# EAGLE board A6BP-3 (EAGLE 7.5.0), part 1 of 2
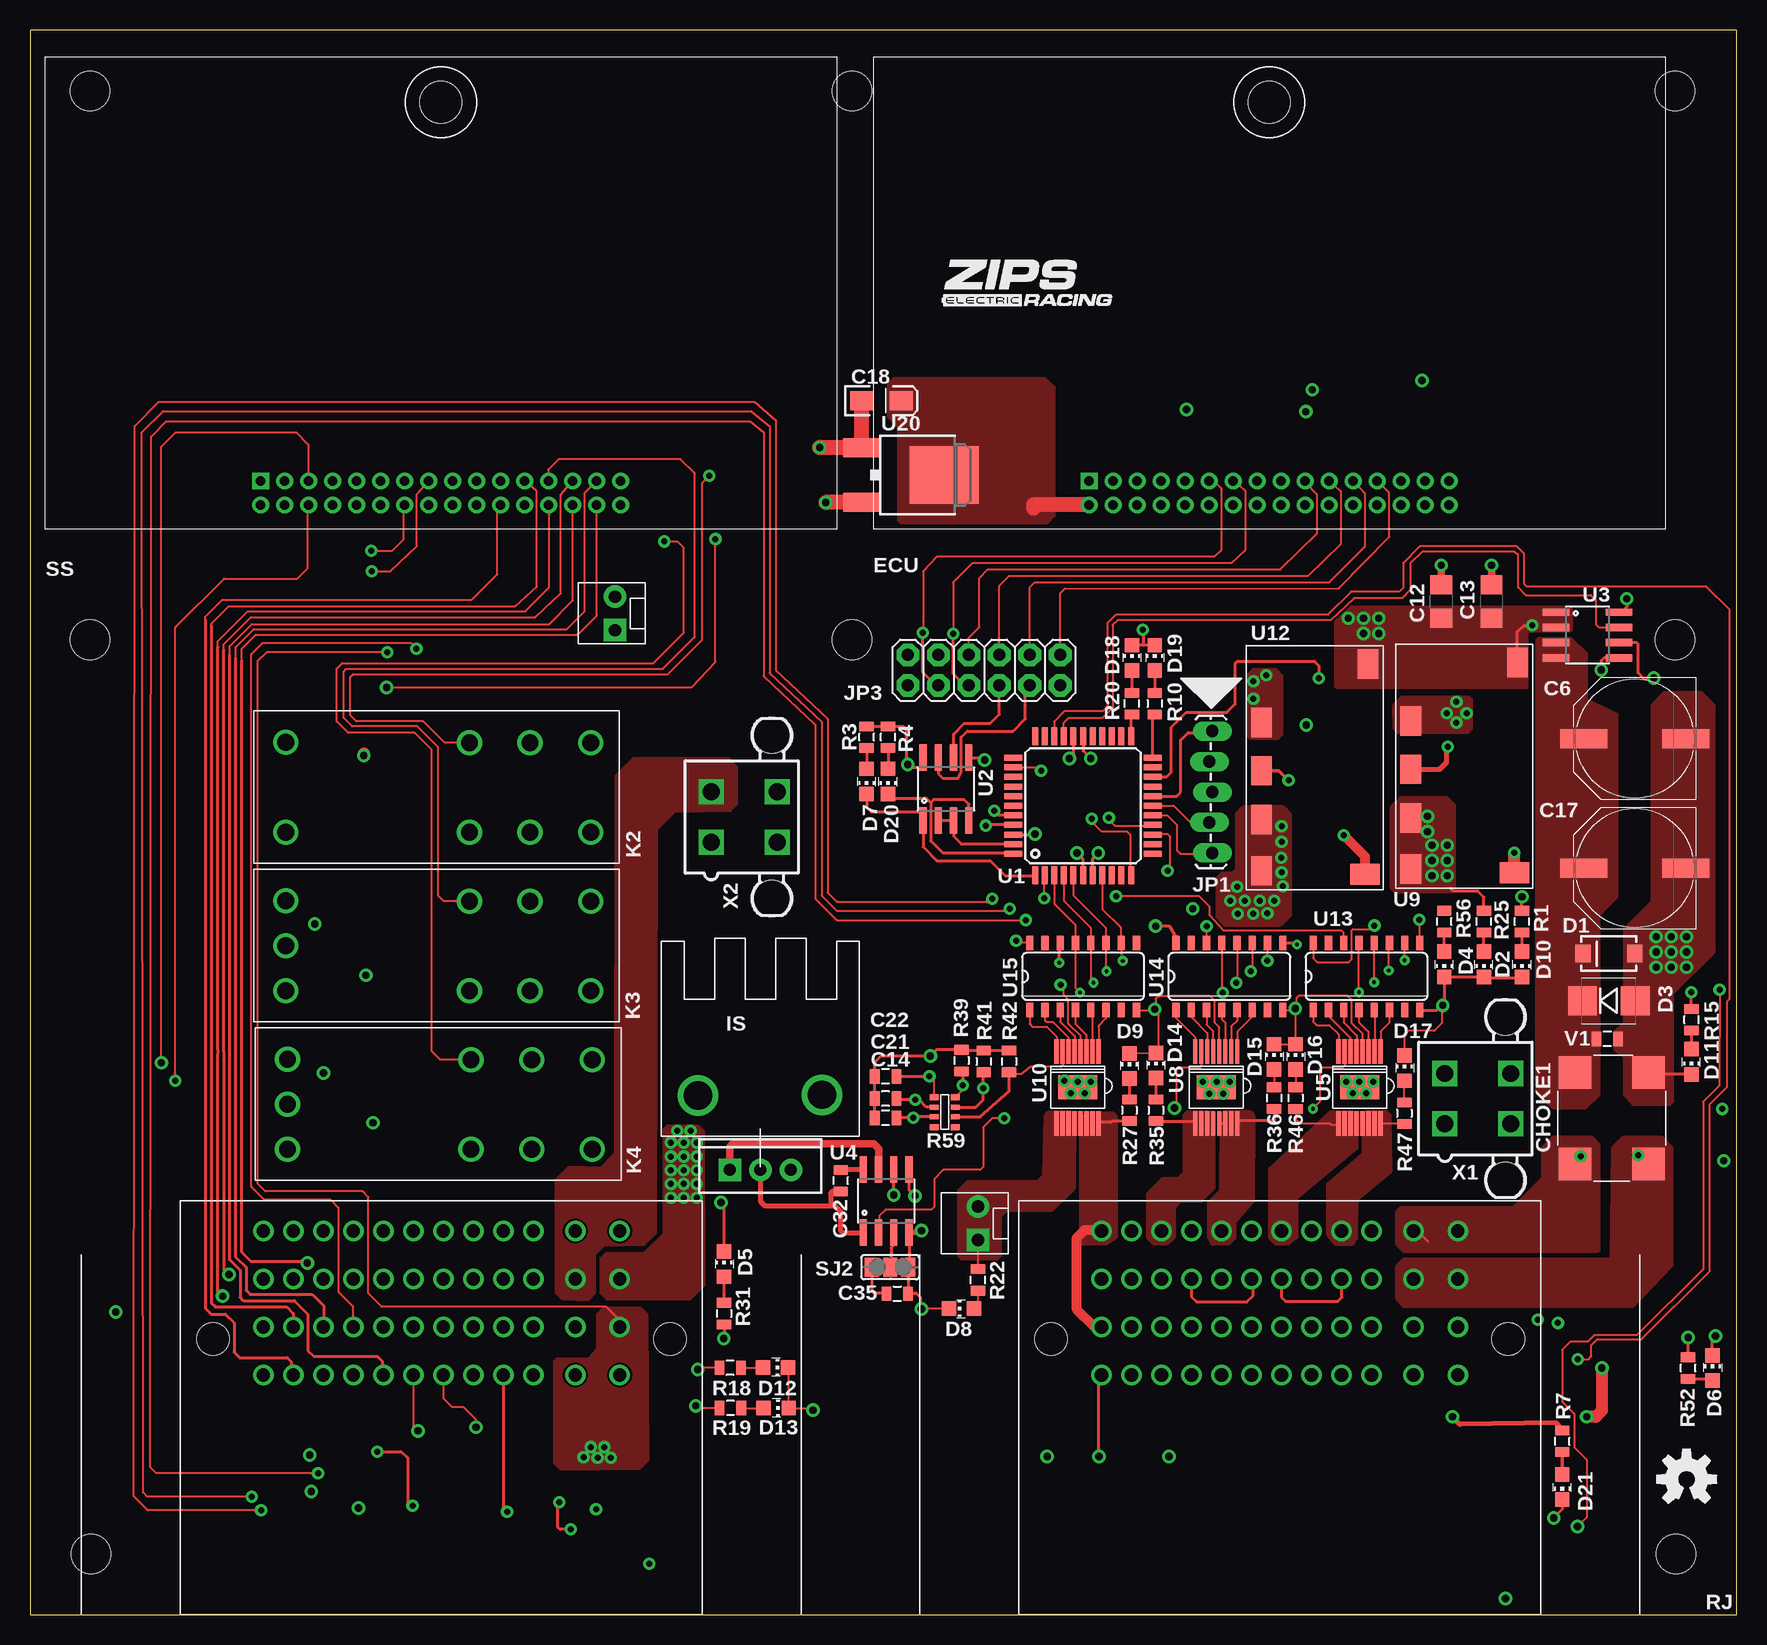
[diagram p6: board, top side]
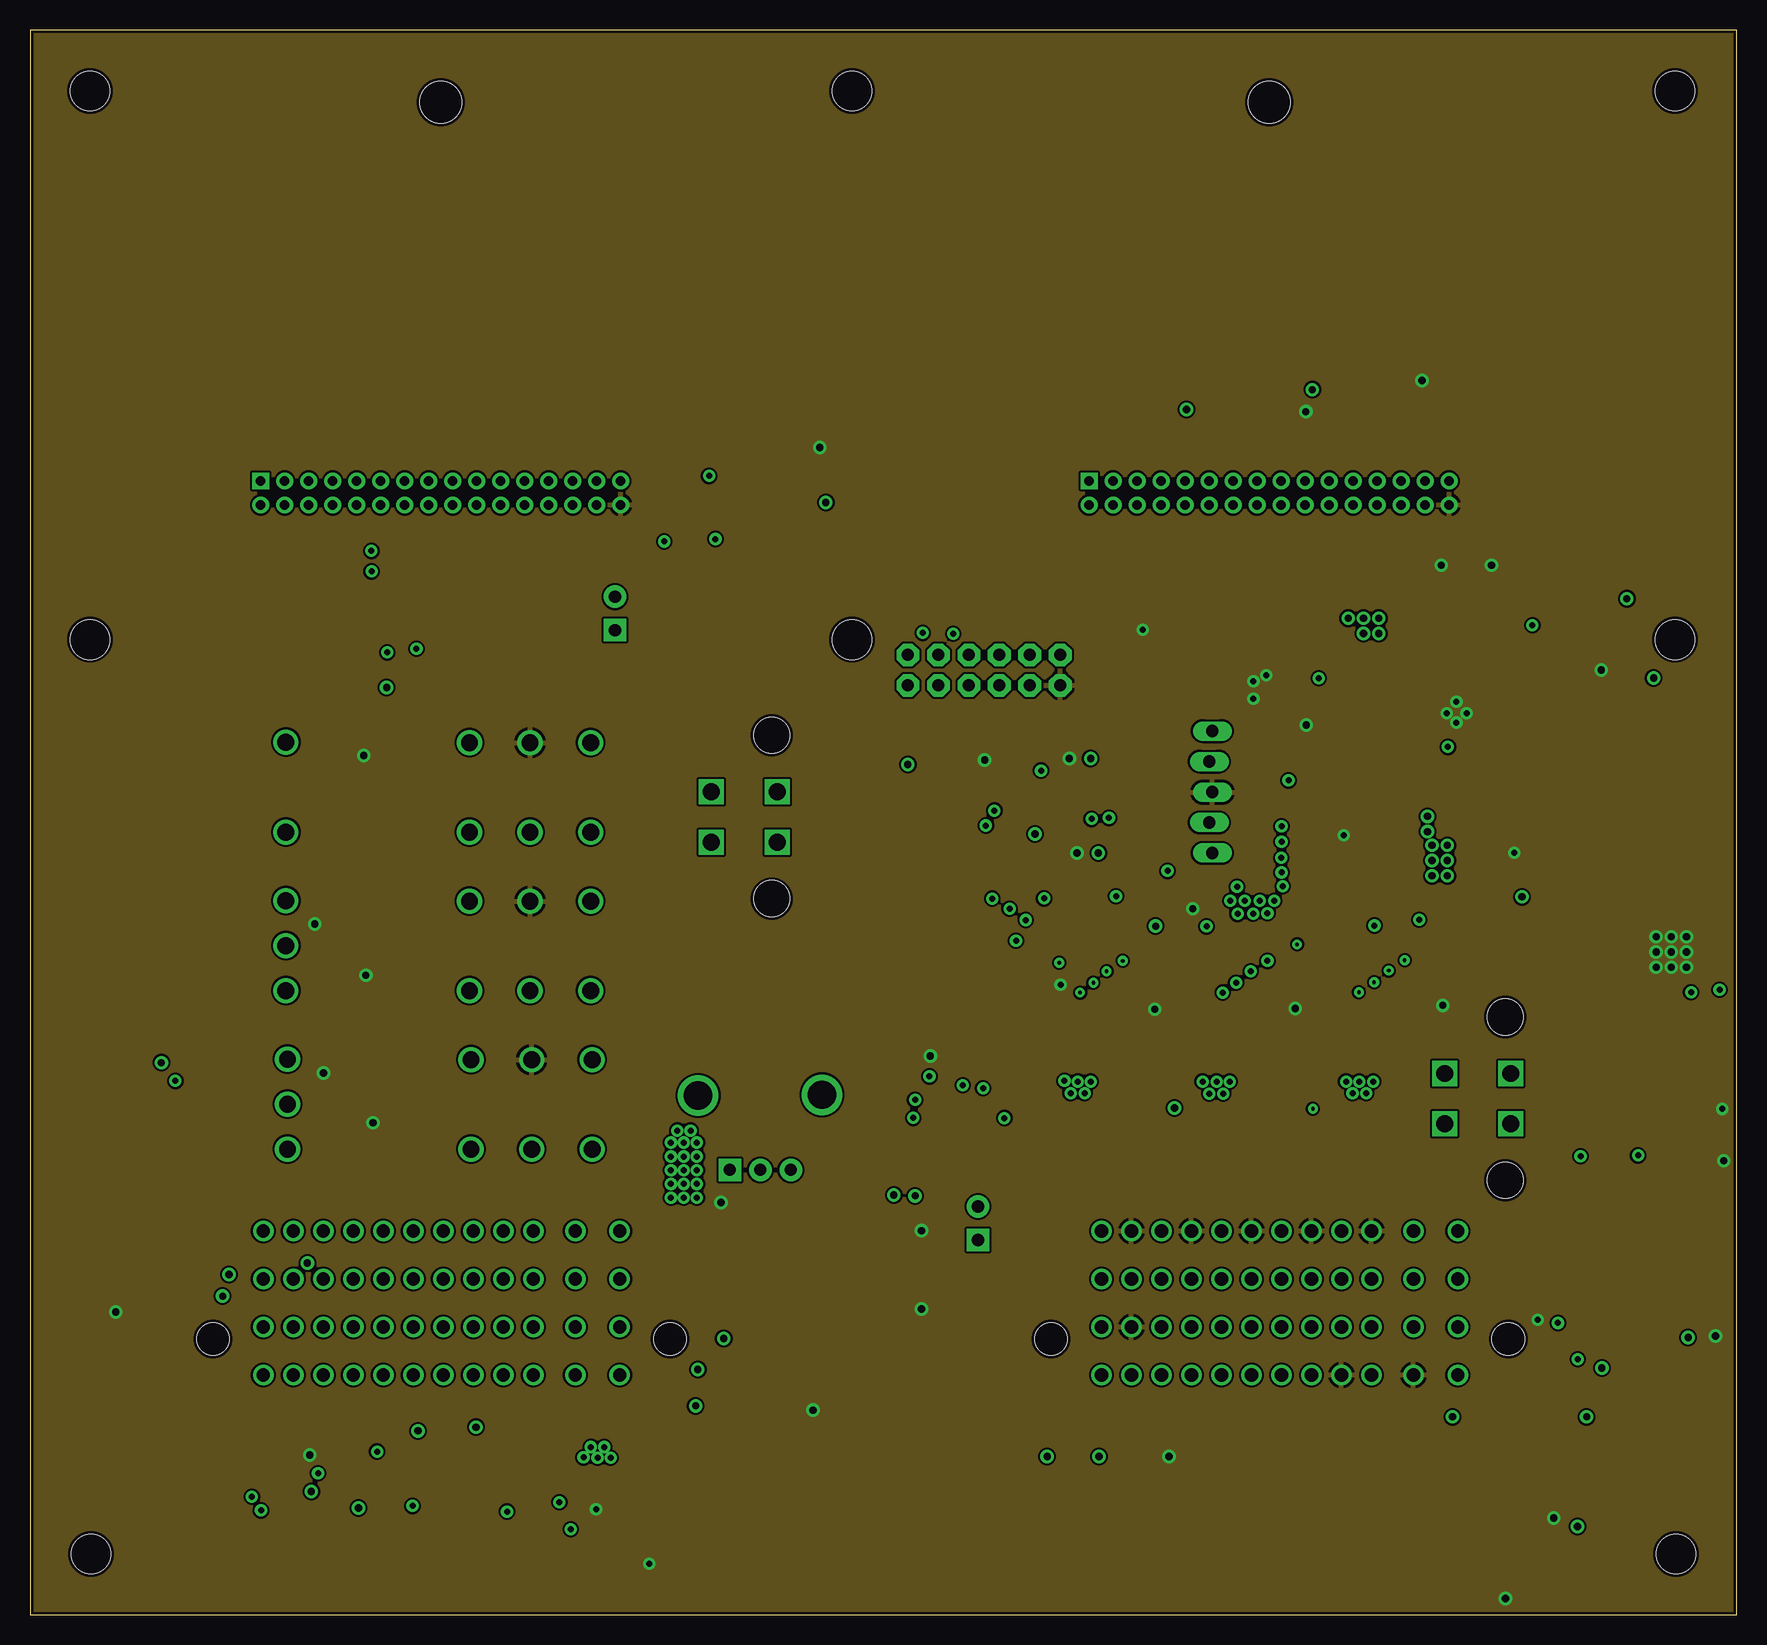
[diagram p7: board, inner layer Route2]
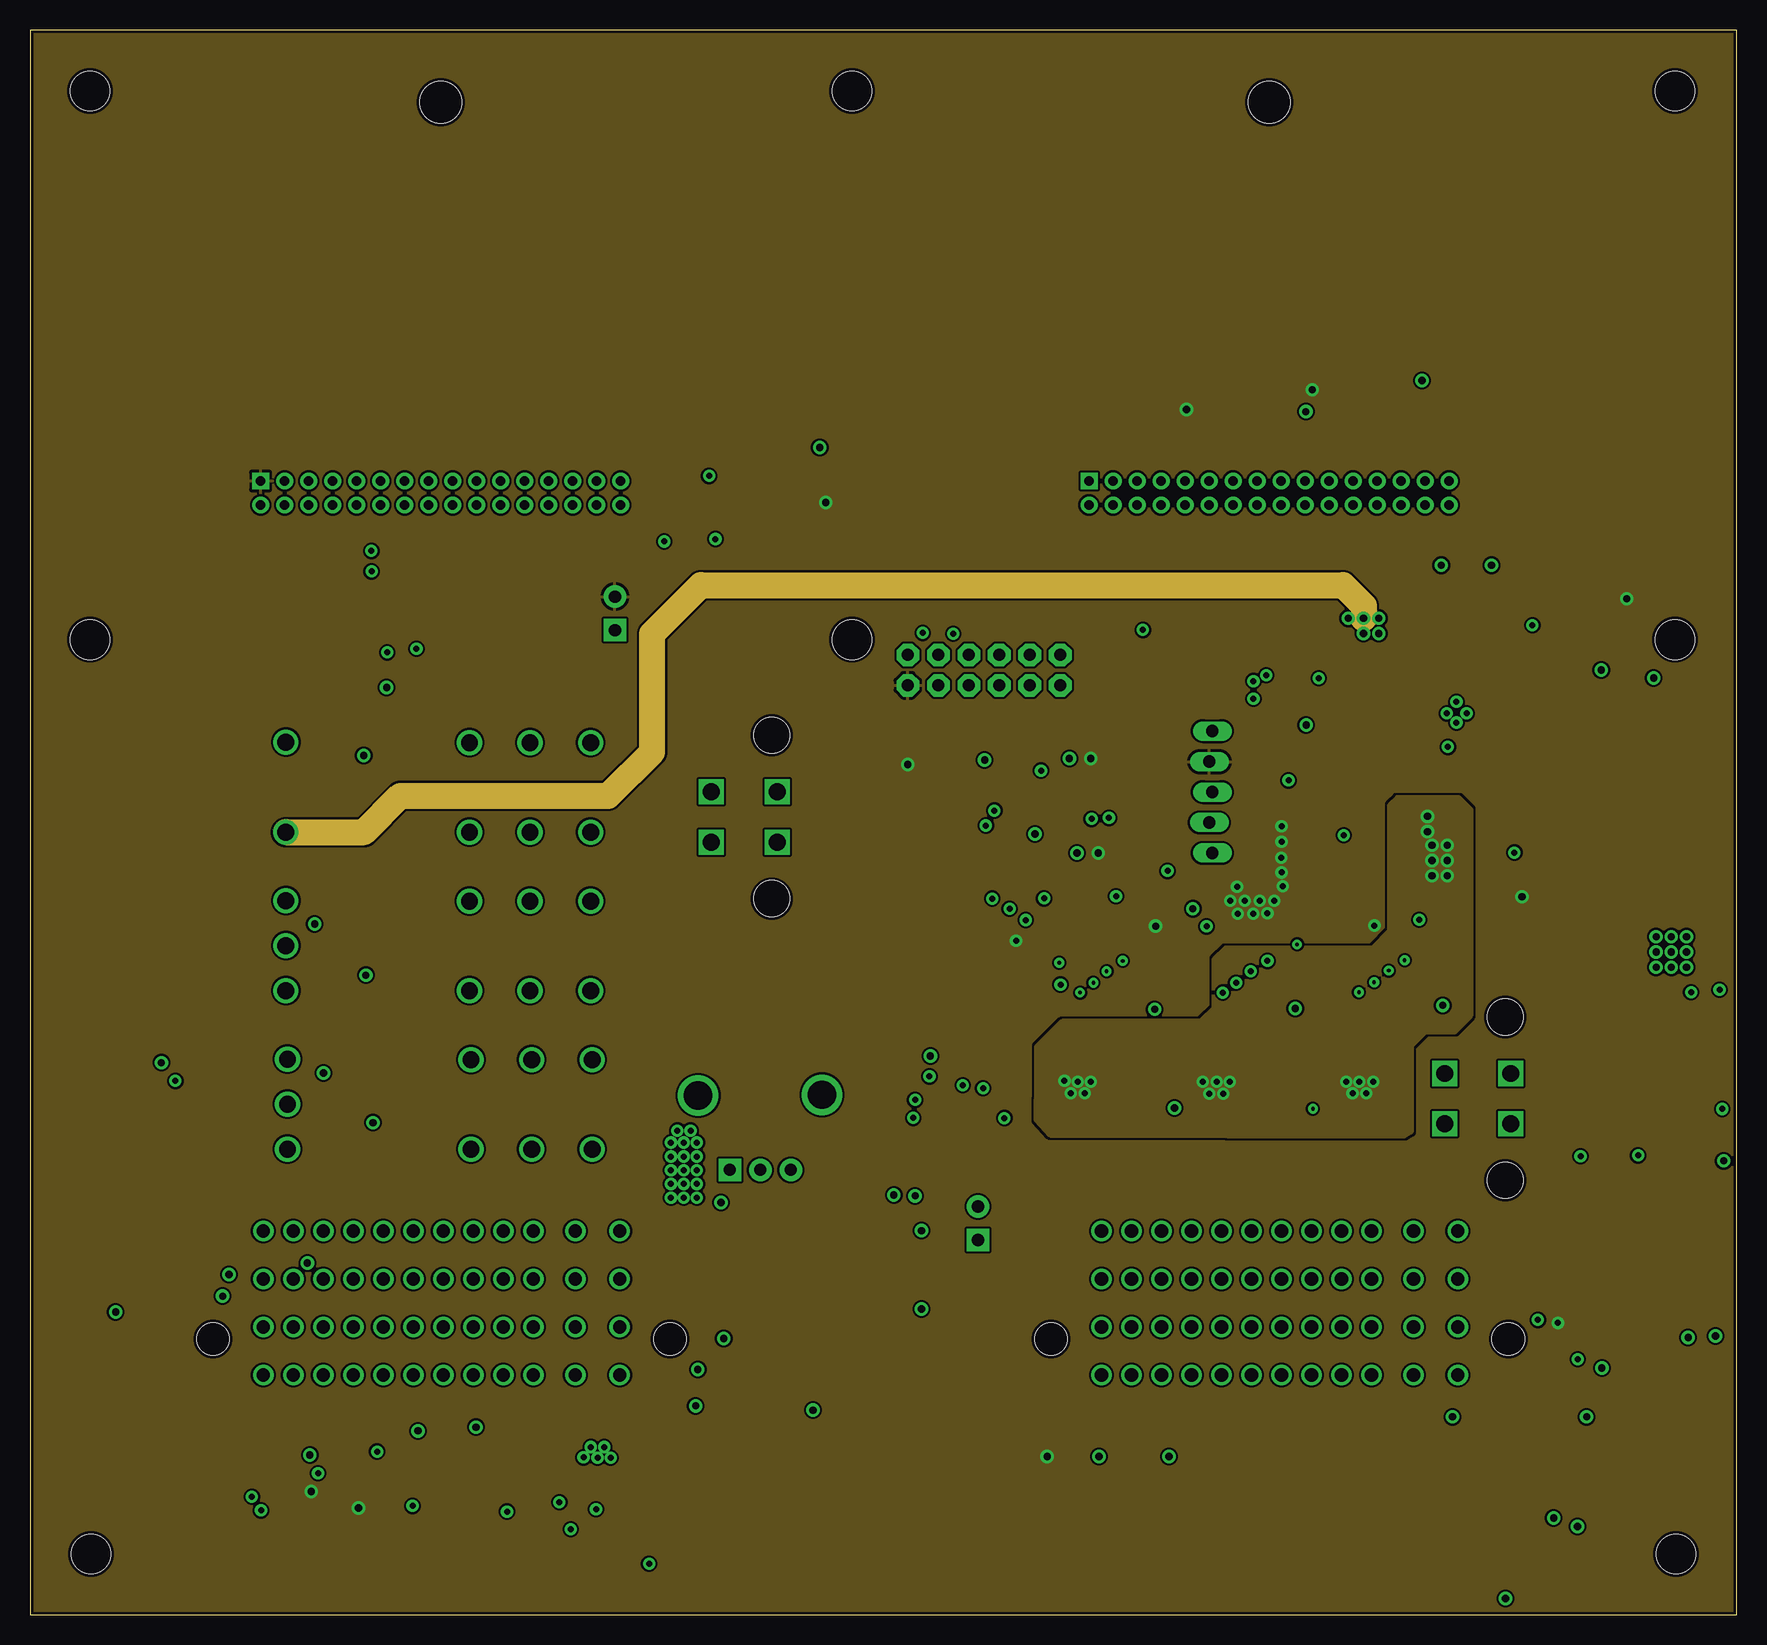
[diagram p8: board, inner layer Route15]
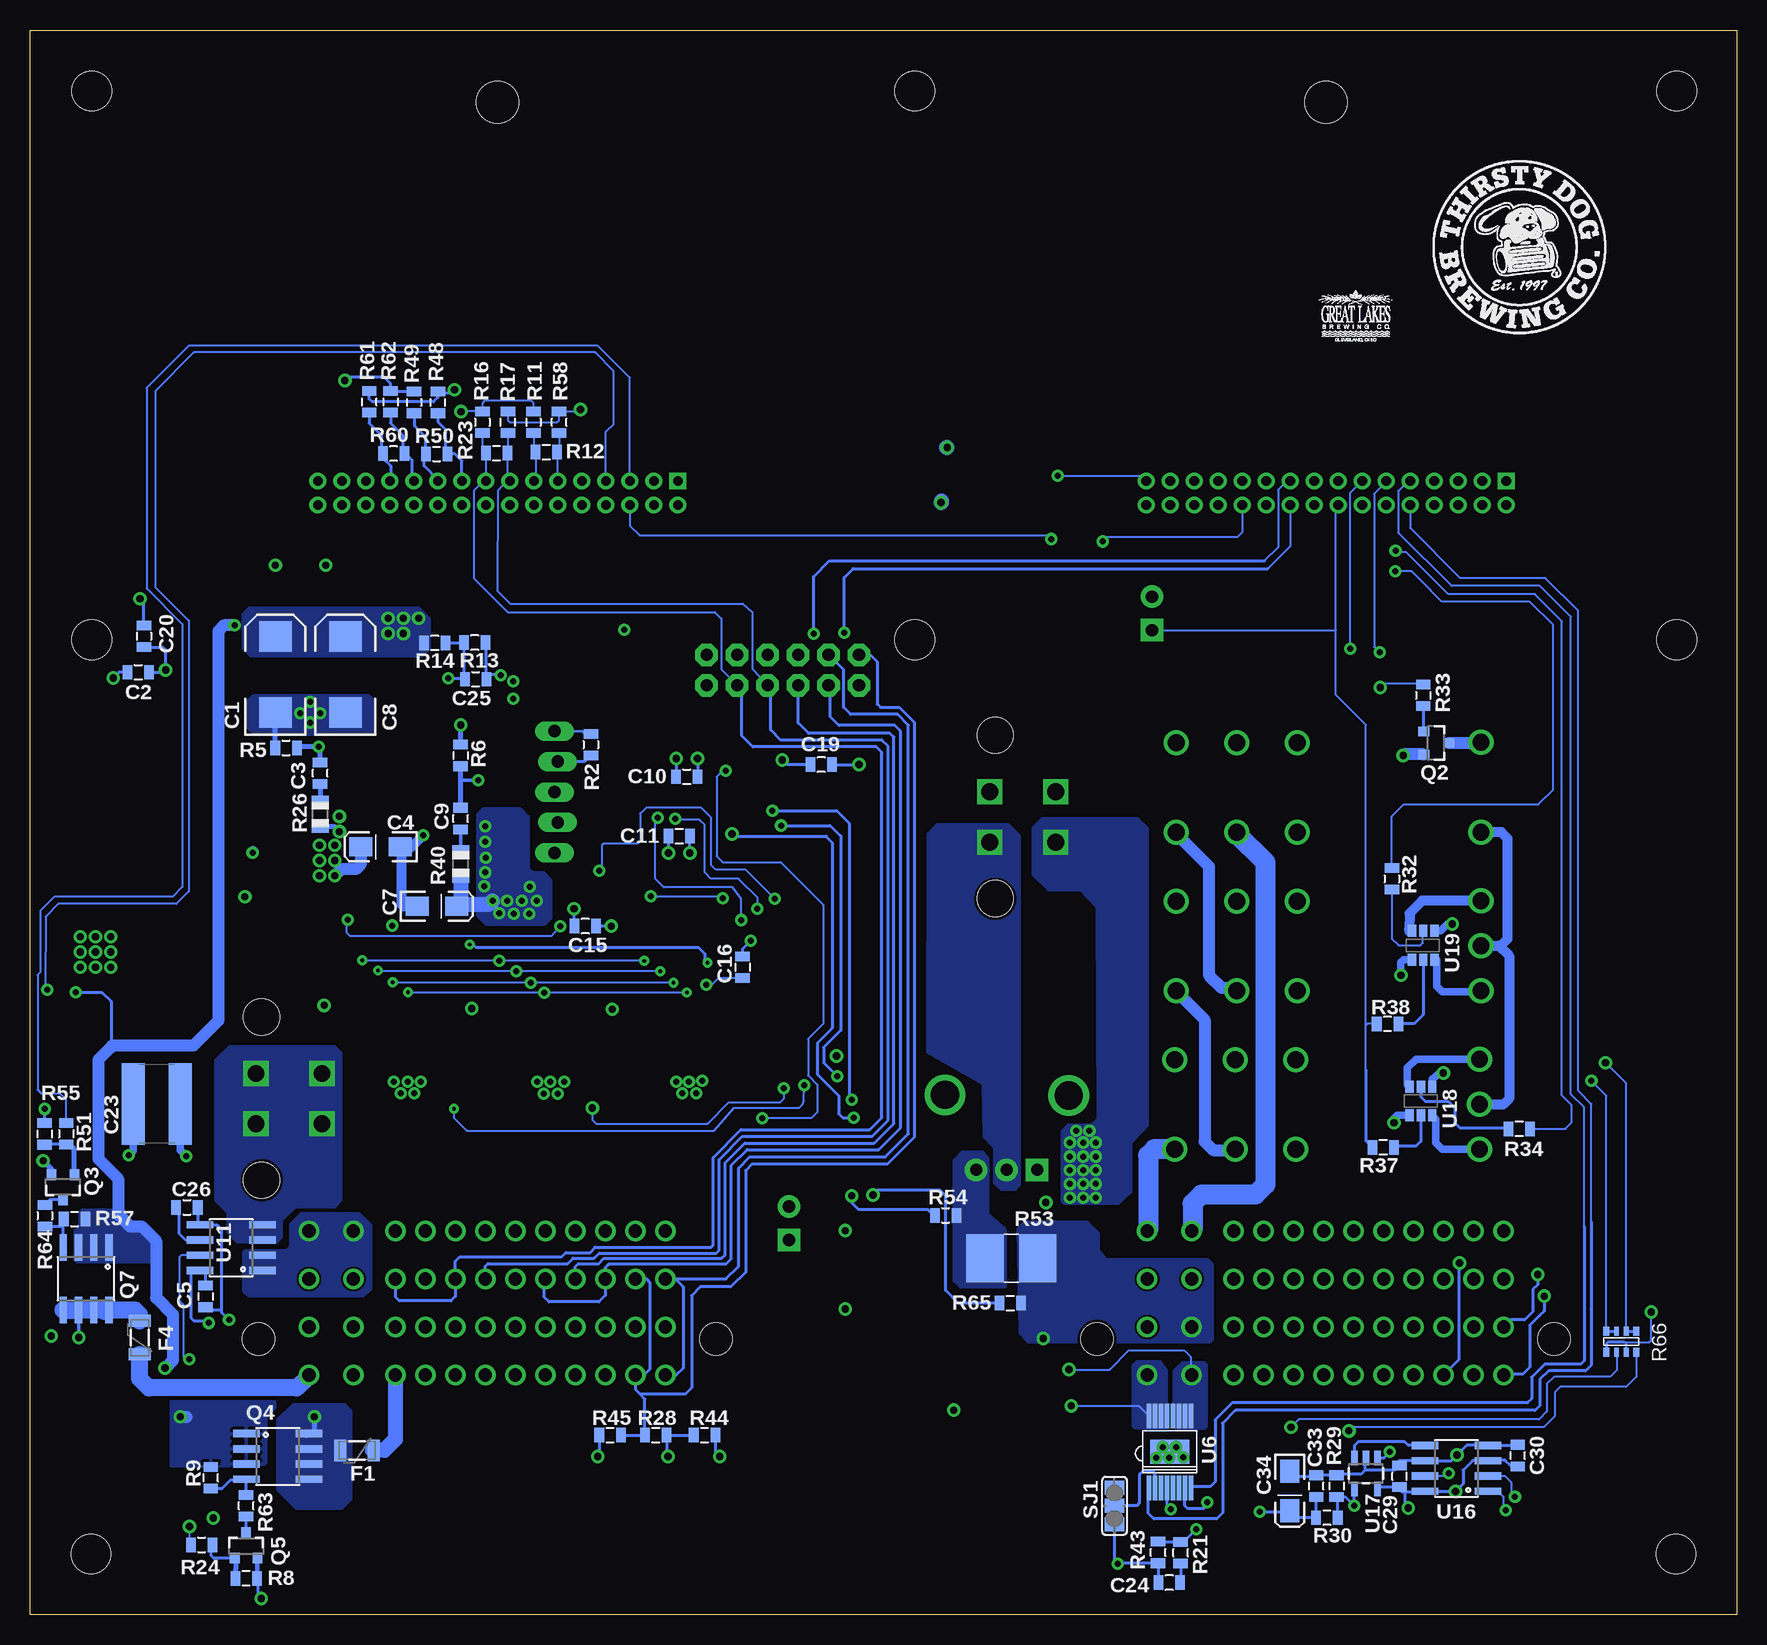
[diagram p9: board, bottom side, seen from below]

Size 142.24 x 132.08 mm. Coordinates in mm from the lower left corner, seen from the top.
Outline: 0,0 142.24,0 142.24,132.08 0,132.08 0,0
Copper layers (1*2*15*16): Top 0.035mm / dielectric 1.5mm / Route2 0.035mm / dielectric 0.15mm / Route15 0.035mm / dielectric 0.2mm / Bottom 0.035mm
Design rules "SparkFun4layer *": minimum track width 7mil, minimum drill 12mil, track to track 7mil, track to pad 7mil, pad to pad 7mil, via to via 7mil, smd to smd 7mil, copper to edge 10mil, drill to drill 6mil, minimum pad ring 12mil, minimum via ring 10mil, stop-mask expansion 4mil, vias tented up to drill 25mil, thermal gap 10mil
Net classes: 1 power: width 0.61 mm, drill 0.711 mm, clearance 0.203 mm

## Footprints (pad centres in the part's own frame; a part is rotated, then mirrored left to right if it is on the bottom)
EIA7343 = smd 2.55 x 2.7: A 3.17,0; C -3.17,0
0805 = smd 0.8 x 1.2: 1 -0.9,0; 2 0.9,0
EIA3216-16V = smd 1.9 x 1.6: A 1.65,0; C -1.65,0
PANASONIC-G = smd 3.9 x 1.6: + 4.25,0; - -4.25,0
1206@1 = smd 1.6 x 1.8: 1 -1.4,0; 2 1.4,0
C1825 = smd 6.8 x 1.9: 1 0,-1.95; 2 0,1.95
744272471 = smd 2.7 x 2.7: 1 3.81,3.06; 2 -3.81,3.06; 3 -3.81,-3.06; 4 3.81,-3.06
SMA = smd 1.27 x 1.47: A -2.15,0; C 2.15,0
CHIP_LED0805 = smd 1.2 x 1.2: A 0,-1.05; C 0,1.05
SMB = smd 2.4 x 2.4: A 2.2,0; C -2.2,0
CARD-2016-RCP = drill 0.8 square: 1 18,4 | drill 0.8: 2 18,2; 3 20,4; 4 20,2; 5 22,4; 6 22,2; 7 24,4; 8 24,2; 9 26,4; 10 26,2; 11 28,4; 12 28,2; 13 30,4; 14 30,2; 15 32,4; 16 32,2; 17 34,4; 18 34,2; 19 36,4; 20 36,2; 21 38,4; 22 38,2; 23 40,4; 24 40,2; 25 42,4; 26 42,2; 27 44,4; 28 44,2; 29 46,4; 30 46,2; 31 48,4; 32 48,2 | hole 3.5: 33.02,35.56
PTC-1206 = smd 1 x 1.8: 1 -1.4,0; 2 1.4,0
581002B02500G = drill 2.362: 1 -5.182,3.404; 2 5.144,3.467
36638 = drill 1.1: 1 -14.85,32; 2 -14.85,28; 3 -14.85,24; 4 -14.85,20; 5 -12.35,32; 6 -12.35,28; 7 -12.35,24; 8 -12.35,20; 9 -9.85,32; 10 -9.85,28; 11 -9.85,24; 12 -9.85,20; 13 -7.35,32; 14 -7.35,28; 15 -7.35,24; 16 -7.35,20; 17 -4.85,32; 18 -4.85,28; 19 -4.85,24; 20 -4.85,20; 21 -2.35,32; 22 -2.35,28; 23 -2.35,24; 24 -2.35,20; 25 0.15,32; 26 0.15,28; 27 0.15,24; 28 0.15,20; 29 2.65,32; 30 2.65,28; 31 2.65,24; 32 2.65,20; 33 5.15,32; 34 5.15,28; 35 5.15,24; 36 5.15,20; 37 7.65,32; 38 7.65,28; 39 7.65,24; 40 7.65,20; 41 11.15,32; 42 11.15,28; 43 11.15,24; 44 11.15,20; 45 14.85,32; 46 14.85,28; 47 14.85,24; 48 14.85,20 | hole 2.7: -19.05,23; 19.05,23
MOLEX-1X2 = drill 1.016 pad 1.88 square: 1 -1.397,0 | drill 1.016 pad 1.88: 2 1.397,0
1X05_LOCK_LONGPADS = drill 1.016 long: 1 0,0; 2 2.54,-0.254; 3 5.08,0; 4 7.62,-0.254; 5 10.16,0
2X6 = drill 1.016 pad 1.88 octagon: 1 0,0; 2 0,2.54; 3 2.54,0; 4 2.54,2.54; 5 5.08,0; 6 5.08,2.54; 7 7.62,0; 8 7.62,2.54; 9 10.16,0; 10 10.16,2.54; 11 12.7,0; 12 12.7,2.54
RTE44024F = drill 1.4: 11 9.06,-3.75; 12 4.01,-3.75; 14 14.11,-3.75; 21 9.06,3.7; 22 4.01,3.7; 24 14.11,3.7; A1 -11.29,-3.75; A2 -11.29,3.75
RT424F24 = drill 1.4: 11 11.6,-3.75; 12 6.55,-3.75; 14 16.65,-3.75; 21 11.6,3.7; 22 6.55,3.7; 24 16.65,3.7; A1 -8.75,-3.75; A2 -8.75,3.75; A3 -8.75,0
TO-220 = drill 1 pad 1.88 square: 1 -2.54,0 | drill 1 pad 1.88: 2 0,0; 3 2.54,0
SOT23 = smd 0.8 x 0.9: 1 -0.95,-1; 2 0.95,-1; 3 0,1.1
SO08 = smd 0.61 x 2.21: 1 -1.905,-2.616; 2 -0.635,-2.616; 3 0.635,-2.616; 4 1.905,-2.616; 5 1.905,2.616; 6 0.635,2.616; 7 -0.635,2.616; 8 -1.905,2.616
R0805 = smd 1.1 x 1.4: 1 -1,0; 2 1,0
2512 = smd 3.1 x 4: 1 -2.2,0; 2 2.2,0
MNR14 = smd 0.5 x 0.75: 1 -1.25,-0.9; 4 1.25,-0.9; 5 1.25,0.85; 8 -1.25,0.85 | smd 0.4 x 0.75: 2 -0.4,-0.9; 3 0.4,-0.9; 6 0.4,0.85; 7 -0.4,0.85
PAD-JUMPER-3-NO_YES_SILK_FULL_BOX = smd 1.168 x 1.6: 1 -1.524,0; 2 0,0; 3 1.524,0
STAND-OFF = hole 3.302: 0,0
TQFP-44 = smd 1.5 x 0.5: 1 -5.8,4; 2 -5.8,3.2; 3 -5.8,2.4; 4 -5.8,1.6; 5 -5.8,0.8; 6 -5.8,0; 7 -5.8,-0.8; 8 -5.8,-1.6; 9 -5.8,-2.4; 10 -5.8,-3.2; 11 -5.8,-4; 23 5.8,-4; 24 5.8,-3.2; 25 5.8,-2.4; 26 5.8,-1.6; 27 5.8,-0.8; 28 5.8,0; 29 5.8,0.8; 30 5.8,1.6; 31 5.8,2.4; 32 5.8,3.2; 33 5.8,4 | smd 0.5 x 1.5: 12 -4,-5.8; 13 -3.2,-5.8; 14 -2.4,-5.8; 15 -1.6,-5.8; 16 -0.8,-5.8; 17 0,-5.8; 18 0.8,-5.8; 19 1.6,-5.8; 20 2.4,-5.8; 21 3.2,-5.8; 22 4,-5.8; 34 4,5.8; 35 3.2,5.8; 36 2.4,5.8; 37 1.6,5.8; 38 0.8,5.8; 39 0,5.8; 40 -0.8,5.8; 41 -1.6,5.8; 42 -2.4,5.8; 43 -3.2,5.8; 44 -4,5.8
SO-8 = smd 0.61 x 2.21: 1 -1.905,-2.616; 2 -0.635,-2.616; 3 0.635,-2.616; 4 1.905,-2.616; 5 1.905,2.616; 6 0.635,2.616; 7 -0.635,2.616; 8 -1.905,2.616
SSO-16-POWER = smd 2.032 x 0.35: 1 -3,1.75; 2 -3,1.25; 3 -3,0.75; 4 -3,0.25; 5 -3,-0.25; 6 -3,-0.75; 7 -3,-1.25; 8 -3,-1.75; 9 3,-1.75; 10 3,-1.25; 11 3,-0.75; 12 3,-0.25; 13 3,0.25; 14 3,0.75; 15 3,1.25; 16 3,1.75 | smd 2 x 3.25: EP 0,0
APXW003A0X3-SRZ = smd 1.73 x 2.44: 1 -8.88,-3.56 | smd 2.44 x 1.73: 2 8.636,-3.81; 3 3.76,5.08; 4 -0.254,5.08; 5 -4.318,5.08; 6 -8.586,5.08
SO-16 = smd 0.6 x 1.2: 1 -4.445,-2.8; 2 -3.175,-2.8; 3 -1.905,-2.8; 4 -0.635,-2.8; 5 0.635,-2.8; 6 1.905,-2.8; 7 3.175,-2.8; 8 4.445,-2.8; 9 4.445,2.8; 10 3.175,2.8; 11 1.905,2.8; 12 0.635,2.8; 13 -0.635,2.8; 14 -1.905,2.8; 15 -3.175,2.8; 16 -4.445,2.8
SOT23-5 = smd 0.55 x 1.2: 1 -0.95,-1.3; 2 0,-1.3; 3 0.95,-1.3; 4 0.95,1.3; 5 -0.95,1.3
SC74-6 = smd 0.7 x 1: 1 -0.95,-1.2; 2 0,-1.2; 3 0.95,-1.2; 4 0.95,1.2; 5 0,1.2; 6 -0.95,1.2
DPAK = smd 1.6 x 3: 1 -2.28,-4.04; 3 2.28,-4.04 | smd 4.826 x 5.715: 2 0,2.858
5566-4 = drill 1.4 square: 1 2.1,-2.75; 2 -2.1,-2.75; 3 2.1,2.75; 4 -2.1,2.75 | hole 3: 6.8,2.29; -6.8,2.29

## Placement (x,y rotation side)
C1  10UF  [EIA7343]  121.79,78.36 90 bottom
C2  0.1UF  [0805]  133.22,78.56 0 bottom
C3  DNP  [0805]  118.06,70.15 90 bottom
C4  10UF  [EIA3216-16V]  113.03,64.01 180 bottom
C5  0.1UF  [0805]  127.61,26.54 270 bottom
C6  100UF_50V  [PANASONIC-G]  133.73,73.03 180 top
C7  10UF  [EIA3216-16V]  108.33,59.05 0 bottom
C8  10UF  [EIA7343]  115.95,78.36 90 bottom
C9  DNP  [0805]  106.35,66.37 90 bottom
C10  0.1UF  [0805]  87.5,69.85 0 bottom
C11  0.1UF  [0805]  88.14,64.9 0 bottom
C12  1UF  [1206@1]  117.6,84.45 90 top
C13  1UF  [1206@1]  121.79,84.45 90 top
C14  0.1UF  [0805]  71.3,41.43 180 top
C15  0.1UF  [0805]  95.96,57.4 180 bottom
C16  0.1UF  [0805]  82.85,53.98 270 bottom
C17  100UF_50V  [PANASONIC-G]  133.73,62.23 180 top
C18  10UF  [EIA3216-16V]  70.94,101.19 0 top
C19  0.1UF  [0805]  76.3,70.87 180 bottom
C20  0.1UF  [0805]  132.74,81.56 270 bottom
C21  0.1UF  [0805]  71.3,43.03 180 top
C22  0.1UF  [0805]  71.3,44.88 180 top
C23  1000PF  [C1825]  131.67,42.57 90 bottom
C24  0.1UF  [0805]  47.29,2.69 180 bottom
C25  1UF  [0805]  105.11,77.98 0 bottom
C26  0.1UF  [0805]  129.16,33.96 0 bottom
C29  0.1uF  [0805]  28.12,11.56 90 bottom
C30  0.1uF  [0805]  18.26,13.28 90 bottom
C32  CAP_2.7NF_50V  [0805]  67.56,36.2 90 top
C33  0.1uF  [0805]  35.05,10.74 90 bottom
C34  10UF_16V  [EIA3216-16V]  37.26,10.34 270 bottom
C35  DNP  [0805]  72.26,26.77 0 top
CHOKE1  744272471  [744272471]  131.83,41.4 270 top
D1  33.3V  [SMA]  131.57,55.12 180 top
D2  GREEN  [CHIP_LED0805]  121.16,54.23 180 top
D3  33V  [SMB]  131.57,51.18 0 top
D4  GREEN  [CHIP_LED0805]  117.86,54.23 180 top
D5  GREEN  [CHIP_LED0805]  57.84,29.24 0 top
D6  GREEN  [CHIP_LED0805]  140.21,20.57 0 top
D7  GREEN  [CHIP_LED0805]  69.72,69.47 180 top
D8  GREEN  [CHIP_LED0805]  77.62,25.53 90 top
D9  GREEN  [CHIP_LED0805]  91.62,45.75 0 top
D10  GREEN  [CHIP_LED0805]  124.33,54.23 180 top
D11  GREEN  [CHIP_LED0805]  138.46,46.1 180 top
D12  GREEN  [CHIP_LED0805]  62.13,20.62 270 top
D13  GREEN  [CHIP_LED0805]  62.18,17.25 270 top
D14  GREEN  [CHIP_LED0805]  93.83,45.8 0 top
D15  GREEN  [CHIP_LED0805]  103.68,46.51 0 top
D16  GREEN  [CHIP_LED0805]  105.46,46.51 0 top
D17  GREEN  [CHIP_LED0805]  114.55,45.57 0 top
D18  GREEN  [CHIP_LED0805]  91.82,79.76 0 top
D19  RED  [CHIP_LED0805]  93.73,79.76 0 top
D20  RED  [CHIP_LED0805]  71.5,69.47 180 top
D21  GREEN  [CHIP_LED0805]  127.69,10.67 180 top
ECU  CARD-2016RECP  [CARD-2016-RCP]  70.26,90.5 0 top
F1  PTCSMD  [PTC-1206]  114.99,13.72 180 bottom
F4  PTCSMD  [PTC-1206]  133.1,23.11 90 bottom
HS1  HEATSINK  [581002B02500G]  60.86,39.88 0 top
J1  36638  [36638]  34.29,0 0 top
J2  36638  [36638]  104.14,0 0 top
J3  M2M1X2  [MOLEX-1X2]  78.99,32.64 90 top
J4  M2M1X2  [MOLEX-1X2]  48.74,83.46 90 top
JP1  [1X05_LOCK_LONGPADS]  98.53,73.66 270 top
JP3  2X6 FEMALE  [2X6]  73.15,77.47 0 top
K2  RTE44024F  [RTE44024F]  32.61,68.99 0 top
K3  RT424F24  [RT424F24]  30.07,55.78 0 top
K4  RT424F24  [RT424F24]  30.2,42.57 0 top
Q1  IRLZ44  [TO-220]  60.86,37.08 0 top
Q2  NUD3160LT1G  [SOT23]  25.1,72.67 270 bottom
Q3  BSS123  [SOT23]  139.5,35.69 180 bottom
Q4  Si9435BDY  [SO08]  121.59,13.21 270 bottom
Q5  BSS123  [SOT23]  124.23,5.74 0 bottom
Q7  Si9435BDY  [SO08]  137.57,28.02 180 bottom
R1  1K  [0805]  124.33,57.78 90 top
R2  10K  [0805]  95.5,72.52 270 bottom
R3  1K  [0805]  69.72,73.15 90 top
R4  1K  [0805]  71.5,73.15 90 top
R5  8.45K  [0805]  120.9,72.26 0 bottom
R6  16.2K  [0805]  106.35,71.63 270 bottom
R7  3.3K  [0805]  127.69,14.48 90 top
R8  10K  [0805]  124.23,3.05 180 bottom
R9  10K  [0805]  127.18,11.43 90 bottom
R10  1K  [0805]  93.73,75.95 270 top
R11  620  [0805]  100.28,99.39 270 bottom
R12  120  [0805]  99.21,96.9 0 bottom
R13  24K  [0805]  105.18,81.03 180 bottom
R14  \95.3K  [0805]  108.51,81 180 bottom
R15  3.3k  [0805]  138.46,49.61 90 top
R16  620  [0805]  104.55,99.39 270 bottom
R17  620  [0805]  102.41,99.39 90 bottom
R18  1K  [0805]  58.34,20.6 180 top
R19  1K  [0805]  58.37,17.25 180 top
R20  1K  [0805]  91.82,75.95 90 top
R21  1K  [0805]  46.36,5.18 90 bottom
R22  1.21K  [0805]  78.99,27.91 90 top
R23  120  [0805]  103.35,96.82 0 bottom
R24  1K  [0805]  127.94,5.84 0 bottom
R25  1.2K  [0805]  121.16,57.78 90 top
R26  dnp  [R0805]  118.06,66.73 90 bottom
R27  1.21K  [0805]  91.62,42.06 270 top
R28  120  [0805]  90.09,14.99 0 bottom
R29  100K  [0805]  33.35,10.74 270 bottom
R30  1K  [0805]  34.16,8.1 180 bottom
R31  3.3K  [0805]  57.84,25.12 270 top
R32  1K  [0805]  28.75,61.34 270 bottom
R33  1K  [0805]  26.14,76.63 270 bottom
R34  1K  [0805]  18.14,40.51 180 bottom
R35  1.21K  [0805]  93.83,42.06 270 top
R36  1.21K  [0805]  103.68,43.08 270 top
R37  1K  [0805]  29.46,38.96 180 bottom
R38  1K  [0805]  29.11,49.25 180 bottom
R39  1K  [0805]  77.62,46.2 270 top
R40  dnp  [R0805]  106.35,62.59 90 bottom
R41  1K  [0805]  79.48,46.13 270 top
R42  1K  [0805]  81.58,46.13 270 top
R43  10K  [0805]  48.23,5.21 90 bottom
R44  620  [0805]  86.03,14.99 0 bottom
R45  620  [0805]  93.9,14.99 0 bottom
R46  1.21K  [0805]  105.46,43.08 270 top
R47  1.21K  [0805]  114.53,41.81 270 top
R48  620  [0805]  108.25,101.04 90 bottom
R49  620  [0805]  110.24,101.04 270 bottom
R50  120  [0805]  108.36,96.75 0 bottom
R51  1K  [0805]  139.22,40.11 270 bottom
R52  3.3K  [0805]  138.18,20.57 90 top
R53  0.003_3W  [2512]  60.45,29.74 180 bottom
R54  1k_1%  [0805]  65.94,33.3 0 bottom
R55  10K  [0805]  141.02,40.08 270 bottom
R56  1.2K  [0805]  117.86,57.78 90 top
R57  10K  [0805]  138.53,32.99 0 bottom
R58  620  [0805]  98.15,99.39 90 bottom
R59  10K  [MNR14]  76.25,41.91 270 top
R60  120  [0805]  111.94,96.77 180 bottom
R61  620  [0805]  113.97,101.09 90 bottom
R62  620  [0805]  112.19,101.09 270 bottom
R63  6.04K  [0805]  124.23,9.09 90 bottom
R64  6.04K  [0805]  141,33.27 270 bottom
R65  330_1%  [0805]  60.55,25.98 0 bottom
R66  100K  [MNR14]  9.63,22.76 180 bottom
SJ1  [PAD-JUMPER-3-NO_YES_SILK_FULL_BOX]  51.87,9.09 270 bottom
SJ2  [PAD-JUMPER-3-NO_YES_SILK_FULL_BOX]  71.68,28.98 180 top
SS  CARD-2016RECP  [CARD-2016-RCP]  1.22,90.5 0 top
STANDOFF1  STAND-OFF  [STAND-OFF]  137.08,127 0 top
STANDOFF2  STAND-OFF  [STAND-OFF]  68.5,81.28 90 top
STANDOFF3  STAND-OFF  [STAND-OFF]  137.16,5.08 0 top
STANDOFF4  STAND-OFF  [STAND-OFF]  5,127 0 top
STANDOFF5  STAND-OFF  [STAND-OFF]  5.08,5.08 0 top
STANDOFF6  STAND-OFF  [STAND-OFF]  5,81.28 0 top
STANDOFF7  STAND-OFF  [STAND-OFF]  137.08,81.28 0 top
STANDOFF8  STAND-OFF  [STAND-OFF]  68.5,127 0 top
U1  PIC18F45K22  [TQFP-44]  87.76,67.44 90 top
U2  SN75HVD08DRSOIC  [SO-8]  76.33,68.83 0 top
U3  ACS712-5A  [SO-8]  129.79,81.66 270 top
U4  MIC5021  [SO-8]  71.35,34.49 0 top
U5  VND7040AJTR-E  [SSO-16-POWER]  110.79,43.97 270 top
U6  VND7040AJTR-E  [SSO-16-POWER]  47.24,13.59 90 bottom
U8  VND7040AJTR-E  [SSO-16-POWER]  98.86,43.97 270 top
U9  APXW003A0X3-SRZ  [APXW003A0X3-SRZ]  120.14,70.74 90 top
U10  VND7040AJTR-E  [SSO-16-POWER]  87.3,43.97 270 top
U11  ACS712-30A  [SO-8]  125.48,30.61 90 bottom
U12  APXW003A0X3-SRZ  [APXW003A0X3-SRZ]  107.7,70.61 90 top
U13  SN74LV594ADR  [SO-16]  111.38,53.21 0 top
U14  SN74LV594ADR  [SO-16]  99.95,53.21 0 top
U15  SN74LV594ADR  [SO-16]  87.76,53.21 0 top
U16  X9015_DIGI_POTS  [SO08]  23.37,12.22 90 bottom
U17  OPA344  [SOT23-5]  30.91,11.79 180 bottom
U18  NUD3160DMT1G  [SC74-6]  26.34,42.82 180 bottom
U19  NUD3160DMT1G  [SC74-6]  26.14,55.8 180 bottom
U20  NCP1117DT_3.3  [DPAK]  73.33,95 270 top
U$1  [TD-M]  25.73,106.38 0 bottom
U$2  [GL-S]  34.93,105.92 0 bottom
U$3  [2016-LOGO-L]  29.39,108.61 0 top
U$4  [2016-2-LOGO-L]  75.92,108.97 0 top
U$8  OSHW-LOGOM  [OSHW-LOGO-M]  138.05,11.3 0 top
U$9  INDPK1  [PICKIT-PIN-1]  98.45,75.54 0 top
V1  35V  [0805]  131.45,48.01 180 top
X1  5566-4  [5566-4]  120.65,43.03 270 top
X2  5566-4  [5566-4]  59.51,66.5 270 top